# Vivado block design pfm_dynamic, xcu250-figd2104-2L-e, Vivado 2020.1
# (continued, part 2 of 3)
current_bd_instance /slr1

create_bd_cell -type hier reset_controllers
create_bd_cell -type ip -vlnv xilinx.com:ip:axi_interconnect:2.1 axi_user_interconnect
set_property -dict [list \
  CONFIG.M00_HAS_REGSLICE 4 \
  CONFIG.M01_HAS_REGSLICE 4 \
  CONFIG.S00_HAS_REGSLICE 4 \
] [get_bd_cells axi_user_interconnect]
create_bd_cell -type ip -vlnv xilinx.com:ip:axi_interconnect:2.1 interconnect_axilite_user
set_property -dict [list \
  CONFIG.M00_HAS_REGSLICE 4 \
  CONFIG.M01_HAS_REGSLICE 4 \
  CONFIG.M02_HAS_REGSLICE 4 \
  CONFIG.M03_HAS_REGSLICE 4 \
  CONFIG.M04_HAS_REGSLICE 4 \
  CONFIG.M05_HAS_REGSLICE 4 \
  CONFIG.M06_HAS_REGSLICE 4 \
  CONFIG.M07_HAS_REGSLICE 4 \
  CONFIG.M08_HAS_REGSLICE 4 \
  CONFIG.M09_HAS_REGSLICE 4 \
  CONFIG.M10_HAS_REGSLICE 4 \
  CONFIG.M11_HAS_REGSLICE 4 \
  CONFIG.M12_HAS_REGSLICE 4 \
  CONFIG.M13_HAS_REGSLICE 4 \
  CONFIG.M14_HAS_REGSLICE 4 \
  CONFIG.M15_HAS_REGSLICE 4 \
  CONFIG.M16_HAS_REGSLICE 4 \
  CONFIG.M17_HAS_REGSLICE 4 \
  CONFIG.M18_HAS_REGSLICE 4 \
  CONFIG.M19_HAS_REGSLICE 4 \
  CONFIG.M20_HAS_REGSLICE 4 \
  CONFIG.M21_HAS_REGSLICE 4 \
  CONFIG.M22_HAS_REGSLICE 4 \
  CONFIG.M23_HAS_REGSLICE 4 \
  CONFIG.M24_HAS_REGSLICE 4 \
  CONFIG.M25_HAS_REGSLICE 4 \
  CONFIG.M26_HAS_REGSLICE 4 \
  CONFIG.M27_HAS_REGSLICE 4 \
  CONFIG.M28_HAS_REGSLICE 4 \
  CONFIG.M29_HAS_REGSLICE 4 \
  CONFIG.M30_HAS_REGSLICE 4 \
  CONFIG.M31_HAS_REGSLICE 4 \
  CONFIG.M32_HAS_REGSLICE 4 \
  CONFIG.M33_HAS_REGSLICE 4 \
  CONFIG.M34_HAS_REGSLICE 4 \
  CONFIG.M35_HAS_REGSLICE 4 \
  CONFIG.M36_HAS_REGSLICE 4 \
  CONFIG.M37_HAS_REGSLICE 4 \
  CONFIG.M38_HAS_REGSLICE 4 \
  CONFIG.M39_HAS_REGSLICE 4 \
  CONFIG.M40_HAS_REGSLICE 4 \
  CONFIG.M41_HAS_REGSLICE 4 \
  CONFIG.M42_HAS_REGSLICE 4 \
  CONFIG.M43_HAS_REGSLICE 4 \
  CONFIG.M44_HAS_REGSLICE 4 \
  CONFIG.M45_HAS_REGSLICE 4 \
  CONFIG.M46_HAS_REGSLICE 4 \
  CONFIG.M47_HAS_REGSLICE 4 \
  CONFIG.M48_HAS_REGSLICE 4 \
  CONFIG.M49_HAS_REGSLICE 4 \
  CONFIG.M50_HAS_REGSLICE 4 \
  CONFIG.M51_HAS_REGSLICE 4 \
  CONFIG.M52_HAS_REGSLICE 4 \
  CONFIG.M53_HAS_REGSLICE 4 \
  CONFIG.M54_HAS_REGSLICE 4 \
  CONFIG.M55_HAS_REGSLICE 4 \
  CONFIG.M56_HAS_REGSLICE 4 \
  CONFIG.M57_HAS_REGSLICE 4 \
  CONFIG.M58_HAS_REGSLICE 4 \
  CONFIG.M59_HAS_REGSLICE 4 \
  CONFIG.M60_HAS_REGSLICE 4 \
  CONFIG.M61_HAS_REGSLICE 4 \
  CONFIG.M62_HAS_REGSLICE 4 \
  CONFIG.M63_HAS_REGSLICE 4 \
  CONFIG.NUM_MI 1 \
  CONFIG.NUM_SI 1 \
  CONFIG.S00_HAS_REGSLICE 4 \
  CONFIG.SLR_ASSIGNMENTS SLR1 \
] [get_bd_cells interconnect_axilite_user]
create_bd_cell -type ip -vlnv xilinx.com:ip:axi_clock_converter:2.1 axi_cdc_data
set_property -dict {CONFIG.SLR_ASSIGNMENTS SLR1} [get_bd_cells axi_cdc_data]
create_bd_cell -type ip -vlnv xilinx.com:ip:axi_gpio:2.0 axi_gpio_null
create_bd_cell -type ip -vlnv xilinx.com:ip:axi_register_slice:2.1 axi_user_slrcrossing_mi
set_property -dict [list \
  CONFIG.ADDR_WIDTH 26 \
  CONFIG.PROTOCOL AXI4LITE \
  CONFIG.READ_WRITE_MODE READ_WRITE \
  CONFIG.REG_AR 7 \
  CONFIG.REG_AW 7 \
  CONFIG.REG_B 9 \
  CONFIG.REG_R 9 \
  CONFIG.REG_W 7 \
] [get_bd_cells axi_user_slrcrossing_mi]
create_bd_cell -type ip -vlnv xilinx.com:ip:axi_register_slice:2.1 axi_user_slrcrossing_si
set_property -dict [list \
  CONFIG.ADDR_WIDTH 26 \
  CONFIG.PROTOCOL AXI4LITE \
  CONFIG.READ_WRITE_MODE READ_WRITE \
  CONFIG.REG_AR 9 \
  CONFIG.REG_AW 9 \
  CONFIG.REG_B 7 \
  CONFIG.REG_R 7 \
  CONFIG.REG_W 9 \
] [get_bd_cells axi_user_slrcrossing_si]
create_bd_cell -type ip -vlnv xilinx.com:ip:axi_vip:1.1 axi_vip_data
create_bd_cell -type ip -vlnv xilinx.com:ip:axi_register_slice:2.1 regslice_data
set_property -dict [list \
  CONFIG.ADDR_WIDTH 39 \
  CONFIG.DATA_WIDTH 512 \
  CONFIG.ID_WIDTH 3 \
  CONFIG.PROTOCOL AXI4 \
  CONFIG.READ_WRITE_MODE READ_WRITE \
  CONFIG.REG_AR 1 \
  CONFIG.REG_AW 1 \
  CONFIG.REG_B 1 \
  CONFIG.REG_W 1 \
  CONFIG.SLR_ASSIGNMENTS SLR1 \
] [get_bd_cells regslice_data]

# ---- hierarchy /slr1/reset_controllers ----
current_bd_instance /slr1/reset_controllers
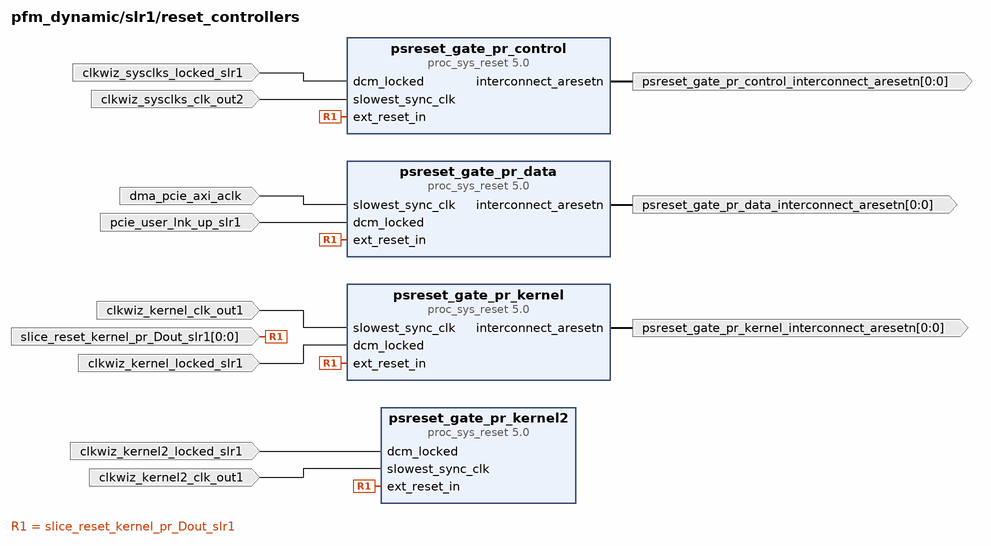
[diagram p11: block diagram inside /slr1/reset_controllers]
create_bd_pin -dir I -type clk clkwiz_kernel2_clk_out1
create_bd_pin -dir I clkwiz_kernel2_locked_slr1
create_bd_pin -dir I -type clk clkwiz_kernel_clk_out1
create_bd_pin -dir I clkwiz_kernel_locked_slr1
create_bd_pin -dir I -type clk clkwiz_sysclks_clk_out2
create_bd_pin -dir I clkwiz_sysclks_locked_slr1
create_bd_pin -dir I -type clk dma_pcie_axi_aclk
create_bd_pin -dir I pcie_user_lnk_up_slr1
create_bd_pin -dir O -from 0 -to 0 -type rst psreset_gate_pr_control_interconnect_aresetn
create_bd_pin -dir O -from 0 -to 0 -type rst psreset_gate_pr_data_interconnect_aresetn
create_bd_pin -dir O -from 0 -to 0 -type rst psreset_gate_pr_kernel_interconnect_aresetn
create_bd_pin -dir I -from 0 -to 0 -type rst slice_reset_kernel_pr_Dout_slr1

create_bd_cell -type ip -vlnv xilinx.com:ip:proc_sys_reset:5.0 psreset_gate_pr_control
set_property -dict [list \
  CONFIG.C_AUX_RESET_HIGH 0 \
  CONFIG.C_AUX_RST_WIDTH 1 \
  CONFIG.C_EXT_RST_WIDTH 1 \
  CONFIG.SLR_ASSIGNMENTS SLR1 \
] [get_bd_cells psreset_gate_pr_control]
create_bd_cell -type ip -vlnv xilinx.com:ip:proc_sys_reset:5.0 psreset_gate_pr_data
set_property -dict [list \
  CONFIG.C_AUX_RESET_HIGH 0 \
  CONFIG.C_AUX_RST_WIDTH 1 \
  CONFIG.C_EXT_RST_WIDTH 1 \
  CONFIG.SLR_ASSIGNMENTS SLR1 \
] [get_bd_cells psreset_gate_pr_data]
create_bd_cell -type ip -vlnv xilinx.com:ip:proc_sys_reset:5.0 psreset_gate_pr_kernel
set_property -dict [list \
  CONFIG.C_AUX_RESET_HIGH 0 \
  CONFIG.C_AUX_RST_WIDTH 1 \
  CONFIG.C_EXT_RST_WIDTH 1 \
  CONFIG.SLR_ASSIGNMENTS SLR1 \
] [get_bd_cells psreset_gate_pr_kernel]
create_bd_cell -type ip -vlnv xilinx.com:ip:proc_sys_reset:5.0 psreset_gate_pr_kernel2
set_property -dict [list \
  CONFIG.C_AUX_RESET_HIGH 0 \
  CONFIG.C_AUX_RST_WIDTH 1 \
  CONFIG.C_EXT_RST_WIDTH 1 \
  CONFIG.SLR_ASSIGNMENTS SLR1 \
] [get_bd_cells psreset_gate_pr_kernel2]

# ---- hierarchy /slr2 ----
current_bd_instance /slr2
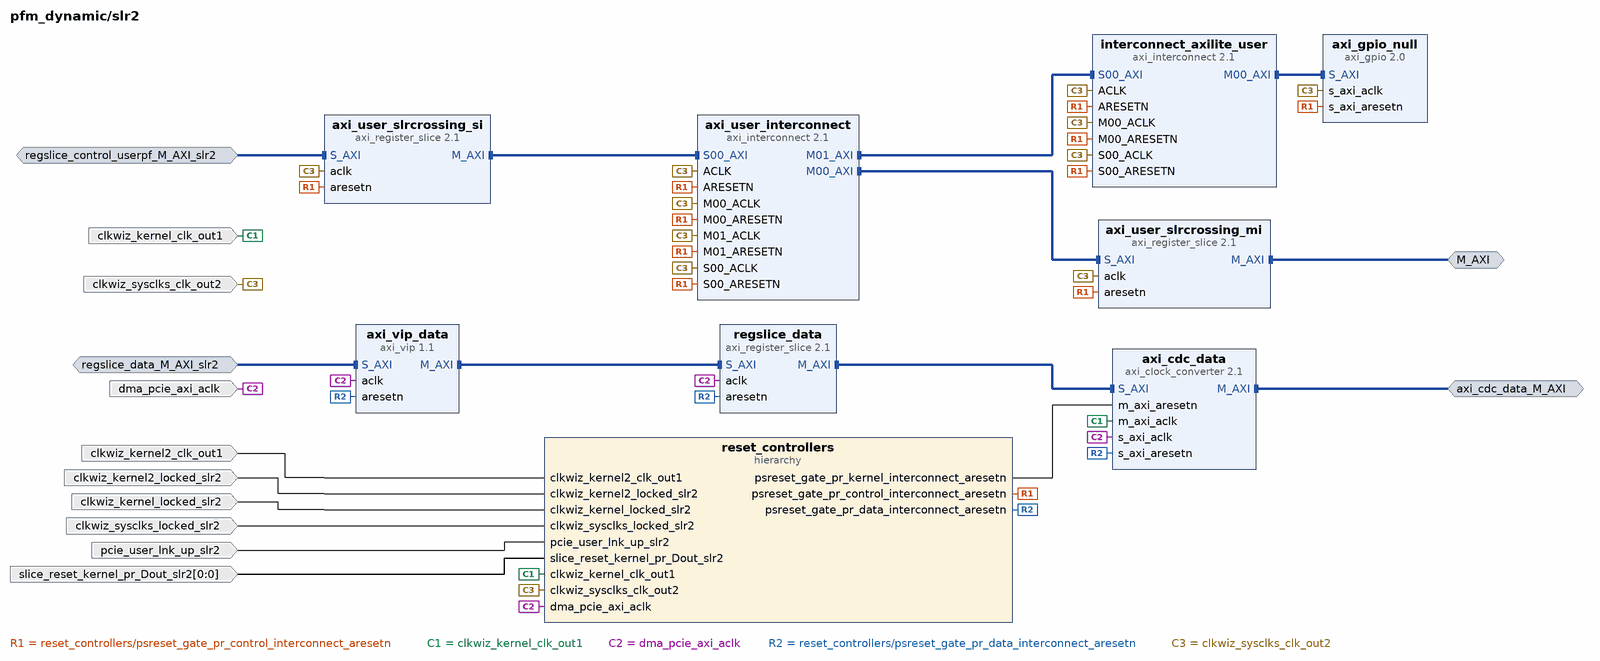
[diagram p12: block diagram inside /slr2]
create_bd_intf_pin -mode Master -vlnv xilinx.com:interface:aximm_rtl:1.0 M_AXI
create_bd_intf_pin -mode Master -vlnv xilinx.com:interface:aximm_rtl:1.0 axi_cdc_data_M_AXI
create_bd_intf_pin -mode Slave -vlnv xilinx.com:interface:aximm_rtl:1.0 regslice_control_userpf_M_AXI_slr2
create_bd_intf_pin -mode Slave -vlnv xilinx.com:interface:aximm_rtl:1.0 regslice_data_M_AXI_slr2
create_bd_pin -dir I -type clk clkwiz_kernel2_clk_out1
create_bd_pin -dir I clkwiz_kernel2_locked_slr2
create_bd_pin -dir I -type clk clkwiz_kernel_clk_out1
create_bd_pin -dir I clkwiz_kernel_locked_slr2
create_bd_pin -dir I -type clk clkwiz_sysclks_clk_out2
create_bd_pin -dir I clkwiz_sysclks_locked_slr2
create_bd_pin -dir I -type clk dma_pcie_axi_aclk
create_bd_pin -dir I pcie_user_lnk_up_slr2
create_bd_pin -dir I -from 0 -to 0 -type rst slice_reset_kernel_pr_Dout_slr2

create_bd_cell -type hier reset_controllers
create_bd_cell -type ip -vlnv xilinx.com:ip:axi_interconnect:2.1 axi_user_interconnect
set_property -dict [list \
  CONFIG.M00_HAS_REGSLICE 4 \
  CONFIG.M01_HAS_REGSLICE 4 \
  CONFIG.S00_HAS_REGSLICE 4 \
] [get_bd_cells axi_user_interconnect]
create_bd_cell -type ip -vlnv xilinx.com:ip:axi_interconnect:2.1 interconnect_axilite_user
set_property -dict [list \
  CONFIG.M00_HAS_REGSLICE 4 \
  CONFIG.M01_HAS_REGSLICE 4 \
  CONFIG.M02_HAS_REGSLICE 4 \
  CONFIG.M03_HAS_REGSLICE 4 \
  CONFIG.M04_HAS_REGSLICE 4 \
  CONFIG.M05_HAS_REGSLICE 4 \
  CONFIG.M06_HAS_REGSLICE 4 \
  CONFIG.M07_HAS_REGSLICE 4 \
  CONFIG.M08_HAS_REGSLICE 4 \
  CONFIG.M09_HAS_REGSLICE 4 \
  CONFIG.M10_HAS_REGSLICE 4 \
  CONFIG.M11_HAS_REGSLICE 4 \
  CONFIG.M12_HAS_REGSLICE 4 \
  CONFIG.M13_HAS_REGSLICE 4 \
  CONFIG.M14_HAS_REGSLICE 4 \
  CONFIG.M15_HAS_REGSLICE 4 \
  CONFIG.M16_HAS_REGSLICE 4 \
  CONFIG.M17_HAS_REGSLICE 4 \
  CONFIG.M18_HAS_REGSLICE 4 \
  CONFIG.M19_HAS_REGSLICE 4 \
  CONFIG.M20_HAS_REGSLICE 4 \
  CONFIG.M21_HAS_REGSLICE 4 \
  CONFIG.M22_HAS_REGSLICE 4 \
  CONFIG.M23_HAS_REGSLICE 4 \
  CONFIG.M24_HAS_REGSLICE 4 \
  CONFIG.M25_HAS_REGSLICE 4 \
  CONFIG.M26_HAS_REGSLICE 4 \
  CONFIG.M27_HAS_REGSLICE 4 \
  CONFIG.M28_HAS_REGSLICE 4 \
  CONFIG.M29_HAS_REGSLICE 4 \
  CONFIG.M30_HAS_REGSLICE 4 \
  CONFIG.M31_HAS_REGSLICE 4 \
  CONFIG.M32_HAS_REGSLICE 4 \
  CONFIG.M33_HAS_REGSLICE 4 \
  CONFIG.M34_HAS_REGSLICE 4 \
  CONFIG.M35_HAS_REGSLICE 4 \
  CONFIG.M36_HAS_REGSLICE 4 \
  CONFIG.M37_HAS_REGSLICE 4 \
  CONFIG.M38_HAS_REGSLICE 4 \
  CONFIG.M39_HAS_REGSLICE 4 \
  CONFIG.M40_HAS_REGSLICE 4 \
  CONFIG.M41_HAS_REGSLICE 4 \
  CONFIG.M42_HAS_REGSLICE 4 \
  CONFIG.M43_HAS_REGSLICE 4 \
  CONFIG.M44_HAS_REGSLICE 4 \
  CONFIG.M45_HAS_REGSLICE 4 \
  CONFIG.M46_HAS_REGSLICE 4 \
  CONFIG.M47_HAS_REGSLICE 4 \
  CONFIG.M48_HAS_REGSLICE 4 \
  CONFIG.M49_HAS_REGSLICE 4 \
  CONFIG.M50_HAS_REGSLICE 4 \
  CONFIG.M51_HAS_REGSLICE 4 \
  CONFIG.M52_HAS_REGSLICE 4 \
  CONFIG.M53_HAS_REGSLICE 4 \
  CONFIG.M54_HAS_REGSLICE 4 \
  CONFIG.M55_HAS_REGSLICE 4 \
  CONFIG.M56_HAS_REGSLICE 4 \
  CONFIG.M57_HAS_REGSLICE 4 \
  CONFIG.M58_HAS_REGSLICE 4 \
  CONFIG.M59_HAS_REGSLICE 4 \
  CONFIG.M60_HAS_REGSLICE 4 \
  CONFIG.M61_HAS_REGSLICE 4 \
  CONFIG.M62_HAS_REGSLICE 4 \
  CONFIG.M63_HAS_REGSLICE 4 \
  CONFIG.NUM_MI 1 \
  CONFIG.NUM_SI 1 \
  CONFIG.S00_HAS_REGSLICE 4 \
  CONFIG.SLR_ASSIGNMENTS SLR2 \
] [get_bd_cells interconnect_axilite_user]
create_bd_cell -type ip -vlnv xilinx.com:ip:axi_clock_converter:2.1 axi_cdc_data
set_property -dict {CONFIG.SLR_ASSIGNMENTS SLR2} [get_bd_cells axi_cdc_data]
create_bd_cell -type ip -vlnv xilinx.com:ip:axi_gpio:2.0 axi_gpio_null
create_bd_cell -type ip -vlnv xilinx.com:ip:axi_register_slice:2.1 axi_user_slrcrossing_mi
set_property -dict [list \
  CONFIG.ADDR_WIDTH 26 \
  CONFIG.PROTOCOL AXI4LITE \
  CONFIG.READ_WRITE_MODE READ_WRITE \
  CONFIG.REG_AR 7 \
  CONFIG.REG_AW 7 \
  CONFIG.REG_B 9 \
  CONFIG.REG_R 9 \
  CONFIG.REG_W 7 \
] [get_bd_cells axi_user_slrcrossing_mi]
create_bd_cell -type ip -vlnv xilinx.com:ip:axi_register_slice:2.1 axi_user_slrcrossing_si
set_property -dict [list \
  CONFIG.ADDR_WIDTH 26 \
  CONFIG.PROTOCOL AXI4LITE \
  CONFIG.READ_WRITE_MODE READ_WRITE \
  CONFIG.REG_AR 9 \
  CONFIG.REG_AW 9 \
  CONFIG.REG_B 7 \
  CONFIG.REG_R 7 \
  CONFIG.REG_W 9 \
] [get_bd_cells axi_user_slrcrossing_si]
create_bd_cell -type ip -vlnv xilinx.com:ip:axi_vip:1.1 axi_vip_data
create_bd_cell -type ip -vlnv xilinx.com:ip:axi_register_slice:2.1 regslice_data
set_property -dict [list \
  CONFIG.ADDR_WIDTH 39 \
  CONFIG.DATA_WIDTH 512 \
  CONFIG.ID_WIDTH 3 \
  CONFIG.PROTOCOL AXI4 \
  CONFIG.READ_WRITE_MODE READ_WRITE \
  CONFIG.REG_AR 1 \
  CONFIG.REG_AW 1 \
  CONFIG.REG_B 1 \
  CONFIG.REG_W 1 \
  CONFIG.SLR_ASSIGNMENTS SLR2 \
] [get_bd_cells regslice_data]

# ---- hierarchy /slr2/reset_controllers ----
current_bd_instance /slr2/reset_controllers
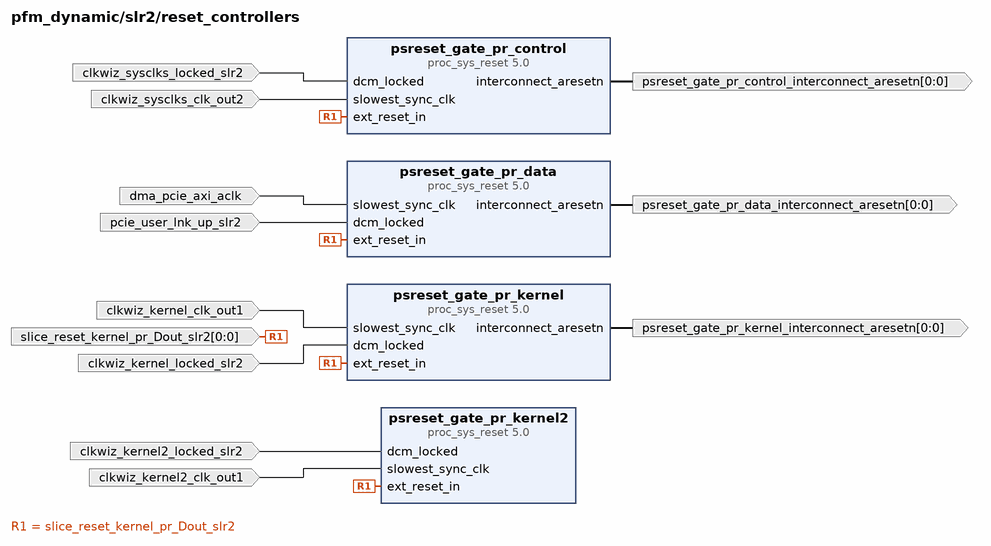
[diagram p13: block diagram inside /slr2/reset_controllers]
create_bd_pin -dir I -type clk clkwiz_kernel2_clk_out1
create_bd_pin -dir I clkwiz_kernel2_locked_slr2
create_bd_pin -dir I -type clk clkwiz_kernel_clk_out1
create_bd_pin -dir I clkwiz_kernel_locked_slr2
create_bd_pin -dir I -type clk clkwiz_sysclks_clk_out2
create_bd_pin -dir I clkwiz_sysclks_locked_slr2
create_bd_pin -dir I -type clk dma_pcie_axi_aclk
create_bd_pin -dir I pcie_user_lnk_up_slr2
create_bd_pin -dir O -from 0 -to 0 -type rst psreset_gate_pr_control_interconnect_aresetn
create_bd_pin -dir O -from 0 -to 0 -type rst psreset_gate_pr_data_interconnect_aresetn
create_bd_pin -dir O -from 0 -to 0 -type rst psreset_gate_pr_kernel_interconnect_aresetn
create_bd_pin -dir I -from 0 -to 0 -type rst slice_reset_kernel_pr_Dout_slr2

create_bd_cell -type ip -vlnv xilinx.com:ip:proc_sys_reset:5.0 psreset_gate_pr_control
set_property -dict [list \
  CONFIG.C_AUX_RESET_HIGH 0 \
  CONFIG.C_AUX_RST_WIDTH 1 \
  CONFIG.C_EXT_RST_WIDTH 1 \
  CONFIG.SLR_ASSIGNMENTS SLR2 \
] [get_bd_cells psreset_gate_pr_control]
create_bd_cell -type ip -vlnv xilinx.com:ip:proc_sys_reset:5.0 psreset_gate_pr_data
set_property -dict [list \
  CONFIG.C_AUX_RESET_HIGH 0 \
  CONFIG.C_AUX_RST_WIDTH 1 \
  CONFIG.C_EXT_RST_WIDTH 1 \
  CONFIG.SLR_ASSIGNMENTS SLR2 \
] [get_bd_cells psreset_gate_pr_data]
create_bd_cell -type ip -vlnv xilinx.com:ip:proc_sys_reset:5.0 psreset_gate_pr_kernel
set_property -dict [list \
  CONFIG.C_AUX_RESET_HIGH 0 \
  CONFIG.C_AUX_RST_WIDTH 1 \
  CONFIG.C_EXT_RST_WIDTH 1 \
  CONFIG.SLR_ASSIGNMENTS SLR2 \
] [get_bd_cells psreset_gate_pr_kernel]
create_bd_cell -type ip -vlnv xilinx.com:ip:proc_sys_reset:5.0 psreset_gate_pr_kernel2
set_property -dict [list \
  CONFIG.C_AUX_RESET_HIGH 0 \
  CONFIG.C_AUX_RST_WIDTH 1 \
  CONFIG.C_EXT_RST_WIDTH 1 \
  CONFIG.SLR_ASSIGNMENTS SLR2 \
] [get_bd_cells psreset_gate_pr_kernel2]

# ---- hierarchy /slr3 ----
current_bd_instance /slr3
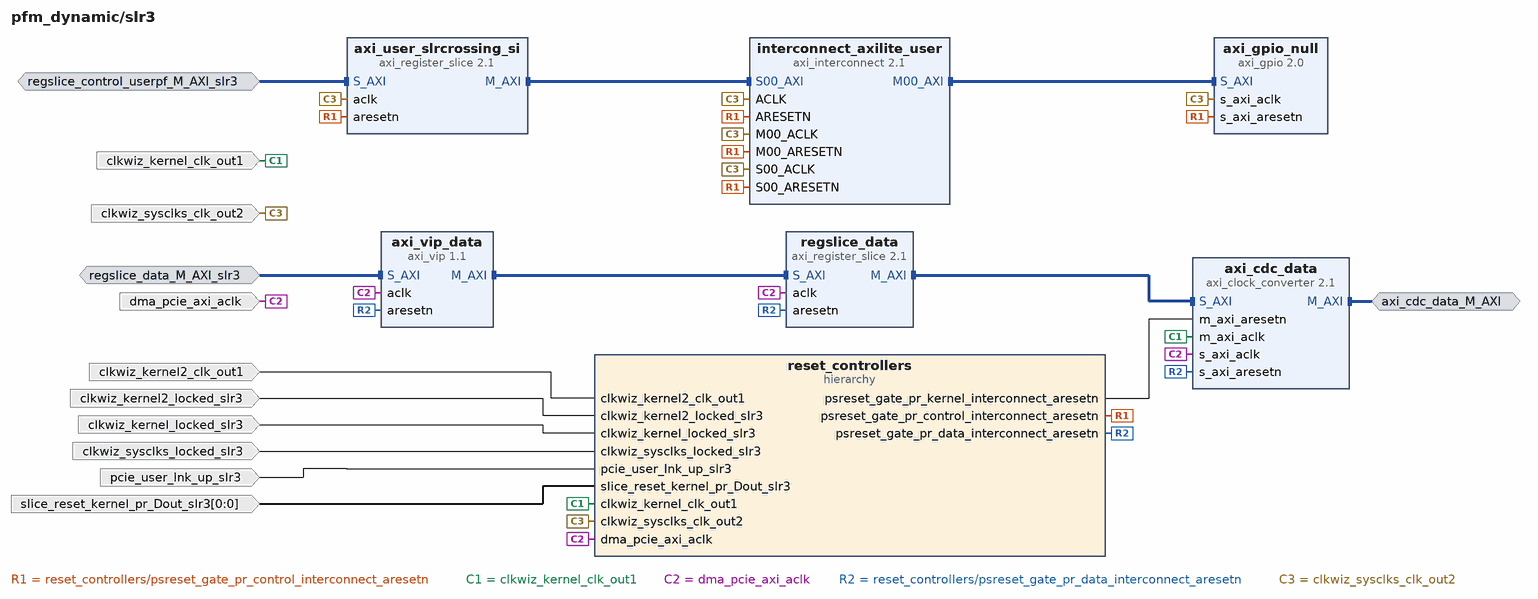
[diagram p14: block diagram inside /slr3]
create_bd_intf_pin -mode Master -vlnv xilinx.com:interface:aximm_rtl:1.0 axi_cdc_data_M_AXI
create_bd_intf_pin -mode Slave -vlnv xilinx.com:interface:aximm_rtl:1.0 regslice_control_userpf_M_AXI_slr3
create_bd_intf_pin -mode Slave -vlnv xilinx.com:interface:aximm_rtl:1.0 regslice_data_M_AXI_slr3
create_bd_pin -dir I -type clk clkwiz_kernel2_clk_out1
create_bd_pin -dir I clkwiz_kernel2_locked_slr3
create_bd_pin -dir I -type clk clkwiz_kernel_clk_out1
create_bd_pin -dir I clkwiz_kernel_locked_slr3
create_bd_pin -dir I -type clk clkwiz_sysclks_clk_out2
create_bd_pin -dir I clkwiz_sysclks_locked_slr3
create_bd_pin -dir I -type clk dma_pcie_axi_aclk
create_bd_pin -dir I pcie_user_lnk_up_slr3
create_bd_pin -dir I -from 0 -to 0 -type rst slice_reset_kernel_pr_Dout_slr3

create_bd_cell -type hier reset_controllers
create_bd_cell -type ip -vlnv xilinx.com:ip:axi_interconnect:2.1 interconnect_axilite_user
set_property -dict [list \
  CONFIG.M00_HAS_REGSLICE 4 \
  CONFIG.M01_HAS_REGSLICE 4 \
  CONFIG.M02_HAS_REGSLICE 4 \
  CONFIG.M03_HAS_REGSLICE 4 \
  CONFIG.M04_HAS_REGSLICE 4 \
  CONFIG.M05_HAS_REGSLICE 4 \
  CONFIG.M06_HAS_REGSLICE 4 \
  CONFIG.M07_HAS_REGSLICE 4 \
  CONFIG.M08_HAS_REGSLICE 4 \
  CONFIG.M09_HAS_REGSLICE 4 \
  CONFIG.M10_HAS_REGSLICE 4 \
  CONFIG.M11_HAS_REGSLICE 4 \
  CONFIG.M12_HAS_REGSLICE 4 \
  CONFIG.M13_HAS_REGSLICE 4 \
  CONFIG.M14_HAS_REGSLICE 4 \
  CONFIG.M15_HAS_REGSLICE 4 \
  CONFIG.M16_HAS_REGSLICE 4 \
  CONFIG.M17_HAS_REGSLICE 4 \
  CONFIG.M18_HAS_REGSLICE 4 \
  CONFIG.M19_HAS_REGSLICE 4 \
  CONFIG.M20_HAS_REGSLICE 4 \
  CONFIG.M21_HAS_REGSLICE 4 \
  CONFIG.M22_HAS_REGSLICE 4 \
  CONFIG.M23_HAS_REGSLICE 4 \
  CONFIG.M24_HAS_REGSLICE 4 \
  CONFIG.M25_HAS_REGSLICE 4 \
  CONFIG.M26_HAS_REGSLICE 4 \
  CONFIG.M27_HAS_REGSLICE 4 \
  CONFIG.M28_HAS_REGSLICE 4 \
  CONFIG.M29_HAS_REGSLICE 4 \
  CONFIG.M30_HAS_REGSLICE 4 \
  CONFIG.M31_HAS_REGSLICE 4 \
  CONFIG.M32_HAS_REGSLICE 4 \
  CONFIG.M33_HAS_REGSLICE 4 \
  CONFIG.M34_HAS_REGSLICE 4 \
  CONFIG.M35_HAS_REGSLICE 4 \
  CONFIG.M36_HAS_REGSLICE 4 \
  CONFIG.M37_HAS_REGSLICE 4 \
  CONFIG.M38_HAS_REGSLICE 4 \
  CONFIG.M39_HAS_REGSLICE 4 \
  CONFIG.M40_HAS_REGSLICE 4 \
  CONFIG.M41_HAS_REGSLICE 4 \
  CONFIG.M42_HAS_REGSLICE 4 \
  CONFIG.M43_HAS_REGSLICE 4 \
  CONFIG.M44_HAS_REGSLICE 4 \
  CONFIG.M45_HAS_REGSLICE 4 \
  CONFIG.M46_HAS_REGSLICE 4 \
  CONFIG.M47_HAS_REGSLICE 4 \
  CONFIG.M48_HAS_REGSLICE 4 \
  CONFIG.M49_HAS_REGSLICE 4 \
  CONFIG.M50_HAS_REGSLICE 4 \
  CONFIG.M51_HAS_REGSLICE 4 \
  CONFIG.M52_HAS_REGSLICE 4 \
  CONFIG.M53_HAS_REGSLICE 4 \
  CONFIG.M54_HAS_REGSLICE 4 \
  CONFIG.M55_HAS_REGSLICE 4 \
  CONFIG.M56_HAS_REGSLICE 4 \
  CONFIG.M57_HAS_REGSLICE 4 \
  CONFIG.M58_HAS_REGSLICE 4 \
  CONFIG.M59_HAS_REGSLICE 4 \
  CONFIG.M60_HAS_REGSLICE 4 \
  CONFIG.M61_HAS_REGSLICE 4 \
  CONFIG.M62_HAS_REGSLICE 4 \
  CONFIG.M63_HAS_REGSLICE 4 \
  CONFIG.NUM_MI 1 \
  CONFIG.NUM_SI 1 \
  CONFIG.S00_HAS_REGSLICE 4 \
  CONFIG.SLR_ASSIGNMENTS SLR3 \
] [get_bd_cells interconnect_axilite_user]
create_bd_cell -type ip -vlnv xilinx.com:ip:axi_clock_converter:2.1 axi_cdc_data
set_property -dict {CONFIG.SLR_ASSIGNMENTS SLR3} [get_bd_cells axi_cdc_data]
create_bd_cell -type ip -vlnv xilinx.com:ip:axi_gpio:2.0 axi_gpio_null
create_bd_cell -type ip -vlnv xilinx.com:ip:axi_register_slice:2.1 axi_user_slrcrossing_si
set_property -dict [list \
  CONFIG.ADDR_WIDTH 26 \
  CONFIG.PROTOCOL AXI4LITE \
  CONFIG.READ_WRITE_MODE READ_WRITE \
  CONFIG.REG_AR 9 \
  CONFIG.REG_AW 9 \
  CONFIG.REG_B 7 \
  CONFIG.REG_R 7 \
  CONFIG.REG_W 9 \
] [get_bd_cells axi_user_slrcrossing_si]
create_bd_cell -type ip -vlnv xilinx.com:ip:axi_vip:1.1 axi_vip_data
create_bd_cell -type ip -vlnv xilinx.com:ip:axi_register_slice:2.1 regslice_data
set_property -dict [list \
  CONFIG.ADDR_WIDTH 39 \
  CONFIG.DATA_WIDTH 512 \
  CONFIG.ID_WIDTH 3 \
  CONFIG.PROTOCOL AXI4 \
  CONFIG.READ_WRITE_MODE READ_WRITE \
  CONFIG.REG_AR 1 \
  CONFIG.REG_AW 1 \
  CONFIG.REG_B 1 \
  CONFIG.REG_W 1 \
  CONFIG.SLR_ASSIGNMENTS SLR3 \
] [get_bd_cells regslice_data]

# ---- hierarchy /slr3/reset_controllers ----
current_bd_instance /slr3/reset_controllers
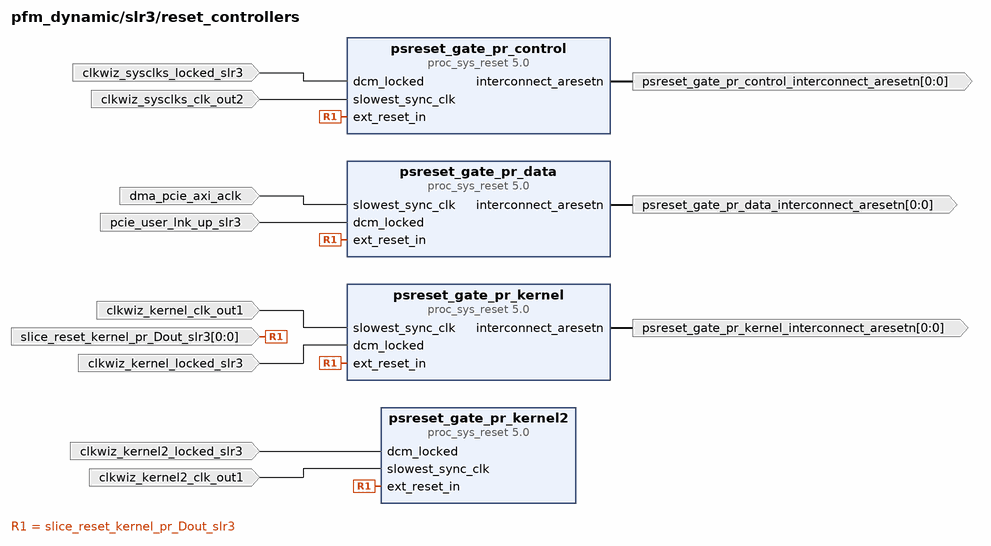
[diagram p15: block diagram inside /slr3/reset_controllers]
create_bd_pin -dir I -type clk clkwiz_kernel2_clk_out1
create_bd_pin -dir I clkwiz_kernel2_locked_slr3
create_bd_pin -dir I -type clk clkwiz_kernel_clk_out1
create_bd_pin -dir I clkwiz_kernel_locked_slr3
create_bd_pin -dir I -type clk clkwiz_sysclks_clk_out2
create_bd_pin -dir I clkwiz_sysclks_locked_slr3
create_bd_pin -dir I -type clk dma_pcie_axi_aclk
create_bd_pin -dir I pcie_user_lnk_up_slr3
create_bd_pin -dir O -from 0 -to 0 -type rst psreset_gate_pr_control_interconnect_aresetn
create_bd_pin -dir O -from 0 -to 0 -type rst psreset_gate_pr_data_interconnect_aresetn
create_bd_pin -dir O -from 0 -to 0 -type rst psreset_gate_pr_kernel_interconnect_aresetn
create_bd_pin -dir I -from 0 -to 0 -type rst slice_reset_kernel_pr_Dout_slr3

create_bd_cell -type ip -vlnv xilinx.com:ip:proc_sys_reset:5.0 psreset_gate_pr_control
set_property -dict [list \
  CONFIG.C_AUX_RESET_HIGH 0 \
  CONFIG.C_AUX_RST_WIDTH 1 \
  CONFIG.C_EXT_RST_WIDTH 1 \
  CONFIG.SLR_ASSIGNMENTS SLR3 \
] [get_bd_cells psreset_gate_pr_control]
create_bd_cell -type ip -vlnv xilinx.com:ip:proc_sys_reset:5.0 psreset_gate_pr_data
set_property -dict [list \
  CONFIG.C_AUX_RESET_HIGH 0 \
  CONFIG.C_AUX_RST_WIDTH 1 \
  CONFIG.C_EXT_RST_WIDTH 1 \
  CONFIG.SLR_ASSIGNMENTS SLR3 \
] [get_bd_cells psreset_gate_pr_data]
create_bd_cell -type ip -vlnv xilinx.com:ip:proc_sys_reset:5.0 psreset_gate_pr_kernel
set_property -dict [list \
  CONFIG.C_AUX_RESET_HIGH 0 \
  CONFIG.C_AUX_RST_WIDTH 1 \
  CONFIG.C_EXT_RST_WIDTH 1 \
  CONFIG.SLR_ASSIGNMENTS SLR3 \
] [get_bd_cells psreset_gate_pr_kernel]
create_bd_cell -type ip -vlnv xilinx.com:ip:proc_sys_reset:5.0 psreset_gate_pr_kernel2
set_property -dict [list \
  CONFIG.C_AUX_RESET_HIGH 0 \
  CONFIG.C_AUX_RST_WIDTH 1 \
  CONFIG.C_EXT_RST_WIDTH 1 \
  CONFIG.SLR_ASSIGNMENTS SLR3 \
] [get_bd_cells psreset_gate_pr_kernel2]

# ---- connections ----

current_bd_instance /interrupt_concat
connect_bd_net [get_bd_pins xlconcat_interrupt_0/dout] [get_bd_pins xlconcat_interrupt/In0]
connect_bd_net [get_bd_pins xlconcat_interrupt_1/dout] [get_bd_pins xlconcat_interrupt/In1]
connect_bd_net [get_bd_pins xlconcat_interrupt_2/dout] [get_bd_pins xlconcat_interrupt/In2]
connect_bd_net [get_bd_pins xlconcat_interrupt_3/dout] [get_bd_pins xlconcat_interrupt/In3]
connect_bd_net [get_bd_pins xlconcat_interrupt/dout] [get_bd_pins xlconcat_interrupt_dout]
connect_bd_net [get_bd_pins xlconstant_gnd/dout] \
  [get_bd_pins xlconcat_interrupt_0/In4] [get_bd_pins xlconcat_interrupt_0/In5] [get_bd_pins xlconcat_interrupt_0/In6] \
  [get_bd_pins xlconcat_interrupt_0/In7] [get_bd_pins xlconcat_interrupt_0/In8] [get_bd_pins xlconcat_interrupt_0/In9] \
  [get_bd_pins xlconcat_interrupt_0/In10] [get_bd_pins xlconcat_interrupt_0/In11] [get_bd_pins xlconcat_interrupt_0/In12] \
  [get_bd_pins xlconcat_interrupt_0/In13] [get_bd_pins xlconcat_interrupt_0/In14] [get_bd_pins xlconcat_interrupt_0/In15] \
  [get_bd_pins xlconcat_interrupt_0/In16] [get_bd_pins xlconcat_interrupt_0/In17] [get_bd_pins xlconcat_interrupt_0/In18] \
  [get_bd_pins xlconcat_interrupt_0/In19] [get_bd_pins xlconcat_interrupt_0/In20] [get_bd_pins xlconcat_interrupt_0/In21] \
  [get_bd_pins xlconcat_interrupt_0/In22] [get_bd_pins xlconcat_interrupt_0/In23] [get_bd_pins xlconcat_interrupt_0/In24] \
  [get_bd_pins xlconcat_interrupt_0/In25] [get_bd_pins xlconcat_interrupt_0/In26] [get_bd_pins xlconcat_interrupt_0/In27] \
  [get_bd_pins xlconcat_interrupt_0/In28] [get_bd_pins xlconcat_interrupt_0/In29] [get_bd_pins xlconcat_interrupt_0/In30] \
  [get_bd_pins xlconcat_interrupt_0/In31] [get_bd_pins xlconcat_interrupt_1/In0] [get_bd_pins xlconcat_interrupt_1/In1] \
  [get_bd_pins xlconcat_interrupt_1/In2] [get_bd_pins xlconcat_interrupt_1/In3] [get_bd_pins xlconcat_interrupt_1/In4] \
  [get_bd_pins xlconcat_interrupt_1/In5] [get_bd_pins xlconcat_interrupt_1/In6] [get_bd_pins xlconcat_interrupt_1/In7] \
  [get_bd_pins xlconcat_interrupt_1/In8] [get_bd_pins xlconcat_interrupt_1/In9] [get_bd_pins xlconcat_interrupt_1/In10] \
  [get_bd_pins xlconcat_interrupt_1/In11] [get_bd_pins xlconcat_interrupt_1/In12] [get_bd_pins xlconcat_interrupt_1/In13] \
  [get_bd_pins xlconcat_interrupt_1/In14] [get_bd_pins xlconcat_interrupt_1/In15] [get_bd_pins xlconcat_interrupt_1/In16] \
  [get_bd_pins xlconcat_interrupt_1/In17] [get_bd_pins xlconcat_interrupt_1/In18] [get_bd_pins xlconcat_interrupt_1/In19] \
  [get_bd_pins xlconcat_interrupt_1/In20] [get_bd_pins xlconcat_interrupt_1/In21] [get_bd_pins xlconcat_interrupt_1/In22] \
  [get_bd_pins xlconcat_interrupt_1/In23] [get_bd_pins xlconcat_interrupt_1/In24] [get_bd_pins xlconcat_interrupt_1/In25] \
  [get_bd_pins xlconcat_interrupt_1/In26] [get_bd_pins xlconcat_interrupt_1/In27] [get_bd_pins xlconcat_interrupt_1/In28] \
  [get_bd_pins xlconcat_interrupt_1/In29] [get_bd_pins xlconcat_interrupt_1/In30] [get_bd_pins xlconcat_interrupt_1/In31] \
  [get_bd_pins xlconcat_interrupt_2/In0] [get_bd_pins xlconcat_interrupt_2/In1] [get_bd_pins xlconcat_interrupt_2/In2] \
  [get_bd_pins xlconcat_interrupt_2/In3] [get_bd_pins xlconcat_interrupt_2/In4] [get_bd_pins xlconcat_interrupt_2/In5] \
  [get_bd_pins xlconcat_interrupt_2/In6] [get_bd_pins xlconcat_interrupt_2/In7] [get_bd_pins xlconcat_interrupt_2/In8] \
  [get_bd_pins xlconcat_interrupt_2/In9] [get_bd_pins xlconcat_interrupt_2/In10] [get_bd_pins xlconcat_interrupt_2/In11] \
  [get_bd_pins xlconcat_interrupt_2/In12] [get_bd_pins xlconcat_interrupt_2/In13] [get_bd_pins xlconcat_interrupt_2/In14] \
  [get_bd_pins xlconcat_interrupt_2/In15] [get_bd_pins xlconcat_interrupt_2/In16] [get_bd_pins xlconcat_interrupt_2/In17] \
  [get_bd_pins xlconcat_interrupt_2/In18] [get_bd_pins xlconcat_interrupt_2/In19] [get_bd_pins xlconcat_interrupt_2/In20] \
  [get_bd_pins xlconcat_interrupt_2/In21] [get_bd_pins xlconcat_interrupt_2/In22] [get_bd_pins xlconcat_interrupt_2/In23] \
  [get_bd_pins xlconcat_interrupt_2/In24] [get_bd_pins xlconcat_interrupt_2/In25] [get_bd_pins xlconcat_interrupt_2/In26] \
  [get_bd_pins xlconcat_interrupt_2/In27] [get_bd_pins xlconcat_interrupt_2/In28] [get_bd_pins xlconcat_interrupt_2/In29] \
  [get_bd_pins xlconcat_interrupt_2/In30] [get_bd_pins xlconcat_interrupt_2/In31] [get_bd_pins xlconcat_interrupt_3/In0] \
  [get_bd_pins xlconcat_interrupt_3/In1] [get_bd_pins xlconcat_interrupt_3/In2] [get_bd_pins xlconcat_interrupt_3/In3] \
  [get_bd_pins xlconcat_interrupt_3/In4] [get_bd_pins xlconcat_interrupt_3/In5] [get_bd_pins xlconcat_interrupt_3/In6] \
  [get_bd_pins xlconcat_interrupt_3/In7] [get_bd_pins xlconcat_interrupt_3/In8] [get_bd_pins xlconcat_interrupt_3/In9] \
  [get_bd_pins xlconcat_interrupt_3/In10] [get_bd_pins xlconcat_interrupt_3/In11] [get_bd_pins xlconcat_interrupt_3/In12] \
  [get_bd_pins xlconcat_interrupt_3/In13] [get_bd_pins xlconcat_interrupt_3/In14] [get_bd_pins xlconcat_interrupt_3/In15] \
  [get_bd_pins xlconcat_interrupt_3/In16] [get_bd_pins xlconcat_interrupt_3/In17] [get_bd_pins xlconcat_interrupt_3/In18] \
  [get_bd_pins xlconcat_interrupt_3/In19] [get_bd_pins xlconcat_interrupt_3/In20] [get_bd_pins xlconcat_interrupt_3/In21] \
  [get_bd_pins xlconcat_interrupt_3/In22] [get_bd_pins xlconcat_interrupt_3/In23] [get_bd_pins xlconcat_interrupt_3/In24] \
  [get_bd_pins xlconcat_interrupt_3/In25] [get_bd_pins xlconcat_interrupt_3/In26] [get_bd_pins xlconcat_interrupt_3/In27] \
  [get_bd_pins xlconcat_interrupt_3/In28] [get_bd_pins xlconcat_interrupt_3/In29] [get_bd_pins xlconcat_interrupt_3/In30] \
  [get_bd_pins xlconcat_interrupt_3/In31]
connect_bd_net -net In0_1 [get_bd_pins In0] [get_bd_pins xlconcat_interrupt_0/In0]
connect_bd_net -net In1_1 [get_bd_pins In1] [get_bd_pins xlconcat_interrupt_0/In1]
connect_bd_net -net In2_1 [get_bd_pins In2] [get_bd_pins xlconcat_interrupt_0/In2]
connect_bd_net -net In3_1 [get_bd_pins In3] [get_bd_pins xlconcat_interrupt_0/In3]

current_bd_instance /slr0
connect_bd_intf_net [get_bd_intf_pins M01_AXI] [get_bd_intf_pins interconnect_axilite_user/M01_AXI]
connect_bd_intf_net [get_bd_intf_pins M02_AXI] [get_bd_intf_pins interconnect_axilite_user/M02_AXI]
connect_bd_intf_net [get_bd_intf_pins M04_AXI] [get_bd_intf_pins interconnect_axilite_user/M04_AXI]
connect_bd_intf_net [get_bd_intf_pins M03_AXI] [get_bd_intf_pins interconnect_axilite_user/M03_AXI]
connect_bd_intf_net [get_bd_intf_pins regslice_data_M_AXI_slr0] [get_bd_intf_pins axi_vip_data/S_AXI]
connect_bd_intf_net [get_bd_intf_pins axi_cdc_data/S_AXI] [get_bd_intf_pins regslice_data/M_AXI]
connect_bd_intf_net [get_bd_intf_pins axi_gpio_null/S_AXI] [get_bd_intf_pins interconnect_axilite_user/M00_AXI]
connect_bd_intf_net [get_bd_intf_pins regslice_control_userpf_M_AXI] [get_bd_intf_pins axi_vip_ctrl_userpf/S_AXI]
connect_bd_intf_net [get_bd_intf_pins regslice_control_periph_M_AXI] [get_bd_intf_pins freq_counter_0/axil]
connect_bd_intf_net [get_bd_intf_pins axi_user_interconnect/S00_AXI] [get_bd_intf_pins axi_vip_ctrl_userpf/M_AXI]
connect_bd_intf_net [get_bd_intf_pins axi_vip_control_mgntpf/M_AXI] [get_bd_intf_pins regslice_control_mgntpf/S_AXI]
connect_bd_intf_net [get_bd_intf_pins axi_cdc_data_M_AXI] [get_bd_intf_pins axi_cdc_data/M_AXI]
connect_bd_intf_net [get_bd_intf_pins axi_user_interconnect/M01_AXI] [get_bd_intf_pins interconnect_axilite_user/S00_AXI]
connect_bd_intf_net [get_bd_intf_pins M_AXI] [get_bd_intf_pins regslice_control_mgntpf/M_AXI]
connect_bd_intf_net [get_bd_intf_pins regslice_control_M_AXI] [get_bd_intf_pins axi_vip_control_mgntpf/S_AXI]
connect_bd_intf_net [get_bd_intf_pins axi_vip_data/M_AXI] [get_bd_intf_pins regslice_data/S_AXI]
connect_bd_intf_net [get_bd_intf_pins M_AXI1] [get_bd_intf_pins axi_user_slrcrossing_mi/M_AXI]
connect_bd_intf_net [get_bd_intf_pins axi_user_interconnect/M00_AXI] [get_bd_intf_pins axi_user_slrcrossing_mi/S_AXI]
connect_bd_net -net ARESETN_1 [get_bd_pins reset_controllers/psreset_gate_pr_control_interconnect_aresetn] \
  [get_bd_pins freq_counter_0/reset_n] [get_bd_pins axi_user_interconnect/ARESETN] \
  [get_bd_pins axi_user_interconnect/S00_ARESETN] [get_bd_pins axi_user_interconnect/M00_ARESETN] \
  [get_bd_pins axi_user_interconnect/M01_ARESETN] [get_bd_pins interconnect_axilite_user/ARESETN] \
  [get_bd_pins interconnect_axilite_user/S00_ARESETN] [get_bd_pins interconnect_axilite_user/M00_ARESETN] \
  [get_bd_pins axi_gpio_null/s_axi_aresetn] [get_bd_pins axi_user_slrcrossing_mi/aresetn] \
  [get_bd_pins axi_vip_control_mgntpf/aresetn] [get_bd_pins axi_vip_ctrl_userpf/aresetn] \
  [get_bd_pins regslice_control_mgntpf/aresetn]
connect_bd_net -net clkwiz_kernel2_clk_out1_1 [get_bd_pins clkwiz_kernel2_clk_out1] \
  [get_bd_pins freq_counter_0/test_clk1] [get_bd_pins reset_controllers/clkwiz_kernel2_clk_out1]
connect_bd_net -net clkwiz_kernel2_locked_1 [get_bd_pins clkwiz_kernel2_locked_slr0] [get_bd_pins reset_controllers/clkwiz_kernel2_locked_slr0]
connect_bd_net -net clkwiz_kernel_clk_out1_1 [get_bd_pins clkwiz_kernel_clk_out1] \
  [get_bd_pins freq_counter_0/test_clk0] [get_bd_pins reset_controllers/clkwiz_kernel_clk_out1] \
  [get_bd_pins axi_cdc_data/m_axi_aclk] [get_bd_pins interconnect_axilite_user/M01_ACLK] \
  [get_bd_pins interconnect_axilite_user/M02_ACLK] [get_bd_pins interconnect_axilite_user/M03_ACLK] \
  [get_bd_pins interconnect_axilite_user/M04_ACLK]
connect_bd_net -net clkwiz_kernel_locked_1 [get_bd_pins clkwiz_kernel_locked_slr0] [get_bd_pins reset_controllers/clkwiz_kernel_locked_slr0]
connect_bd_net -net clkwiz_sysclks_locked_1 [get_bd_pins clkwiz_sysclks_locked_slr0] [get_bd_pins reset_controllers/clkwiz_sysclks_locked_slr0]
connect_bd_net [get_bd_pins dma_pcie_axi_aclk] \
  [get_bd_pins reset_controllers/dma_pcie_axi_aclk] [get_bd_pins axi_cdc_data/s_axi_aclk] [get_bd_pins axi_vip_data/aclk] \
  [get_bd_pins regslice_data/aclk]
connect_bd_net -net pcie_user_lnk_up_1 [get_bd_pins pcie_user_lnk_up_slr0] [get_bd_pins reset_controllers/pcie_user_lnk_up_slr0]
connect_bd_net -net reset_controllers_interconnect_aresetn [get_bd_pins reset_controllers/psreset_gate_pr_data_interconnect_aresetn] \
  [get_bd_pins psreset_gate_pr_data_interconnect_aresetn] [get_bd_pins axi_cdc_data/s_axi_aresetn] \
  [get_bd_pins axi_vip_data/aresetn] [get_bd_pins regslice_data/aresetn]
connect_bd_net -net reset_controllers_interconnect_aresetn1 [get_bd_pins reset_controllers/psreset_gate_pr_kernel_interconnect_aresetn] \
  [get_bd_pins psreset_gate_pr_kernel_interconnect_aresetn] [get_bd_pins axi_cdc_data/m_axi_aresetn] \
  [get_bd_pins interconnect_axilite_user/M01_ARESETN] [get_bd_pins interconnect_axilite_user/M02_ARESETN] \
  [get_bd_pins interconnect_axilite_user/M03_ARESETN] [get_bd_pins interconnect_axilite_user/M04_ARESETN]
connect_bd_net -net slice_reset_kernel_pr_Dout_1 [get_bd_pins slice_reset_kernel_pr_Dout_slr0] \
  [get_bd_pins reset_controllers/slice_reset_kernel_pr_Dout_slr0]
connect_bd_net -net slowest_sync_clk_1 [get_bd_pins clkwiz_sysclks_clk_out2] \
  [get_bd_pins freq_counter_0/clk] [get_bd_pins reset_controllers/clkwiz_sysclks_clk_out2] \
  [get_bd_pins axi_user_interconnect/ACLK] [get_bd_pins axi_user_interconnect/S00_ACLK] \
  [get_bd_pins axi_user_interconnect/M00_ACLK] [get_bd_pins axi_user_interconnect/M01_ACLK] \
  [get_bd_pins interconnect_axilite_user/ACLK] [get_bd_pins interconnect_axilite_user/S00_ACLK] \
  [get_bd_pins interconnect_axilite_user/M00_ACLK] [get_bd_pins axi_gpio_null/s_axi_aclk] \
  [get_bd_pins axi_user_slrcrossing_mi/aclk] [get_bd_pins axi_vip_control_mgntpf/aclk] [get_bd_pins axi_vip_ctrl_userpf/aclk] \
  [get_bd_pins regslice_control_mgntpf/aclk]
connect_bd_net [get_bd_pins reset_controllers/peripheral_aresetn] [get_bd_pins peripheral_aresetn]
set_property PFM.AXI_PORT {M01_AXI {memport "M_AXI_GP"} M02_AXI {memport "M_AXI_GP"} M03_AXI {memport "M_AXI_GP"} M04_AXI {memport "M_AXI_GP"} M05_AXI {memport "M_AXI_GP"} M06_AXI {memport "M_AXI_GP"} M07_AXI {memport "M_AXI_GP"} M08_AXI {memport "M_AXI_GP"} M09_AXI {memport "M_AXI_GP"} M10_AXI {memport "M_AXI_GP"} M11_AXI {memport "M_AXI_GP"} M12_AXI {memport "M_AXI_GP"} M13_AXI {memport "M_AXI_GP"} M14_AXI {memport "M_AXI_GP"} M15_AXI {memport "M_AXI_GP"} M16_AXI {memport "M_AXI_GP"} M17_AXI {memport "M_AXI_GP"} M18_AXI {memport "M_AXI_GP"} M19_AXI {memport "M_AXI_GP"} M20_AXI {memport "M_AXI_GP"} M21_AXI {memport "M_AXI_GP"} M22_AXI {memport "M_AXI_GP"} M23_AXI {memport "M_AXI_GP"} M24_AXI {memport "M_AXI_GP"} M25_AXI {memport "M_AXI_GP"} M26_AXI {memport "M_AXI_GP"} M27_AXI {memport "M_AXI_GP"} M28_AXI {memport "M_AXI_GP"} M29_AXI {memport "M_AXI_GP"} M30_AXI {memport "M_AXI_GP"} M31_AXI {memport "M_AXI_GP"}} [get_bd_cells interconnect_axilite_user]

current_bd_instance /slr0/reset_controllers
connect_bd_net -net clkwiz_kernel2_locked_slr0_1 [get_bd_pins clkwiz_kernel2_locked_slr0] [get_bd_pins psreset_gate_pr_kernel2/dcm_locked]
connect_bd_net [get_bd_pins clkwiz_kernel_clk_out1] [get_bd_pins psreset_gate_pr_kernel/slowest_sync_clk]
connect_bd_net -net clkwiz_kernel_locked_slr0_1 [get_bd_pins clkwiz_kernel_locked_slr0] [get_bd_pins psreset_gate_pr_kernel/dcm_locked]
connect_bd_net -net clkwiz_sysclks_locked_slr0_1 [get_bd_pins clkwiz_sysclks_locked_slr0] [get_bd_pins psreset_gate_pr_control/dcm_locked]
connect_bd_net [get_bd_pins dma_pcie_axi_aclk] [get_bd_pins psreset_gate_pr_data/slowest_sync_clk]
connect_bd_net -net ext_reset_in_1 [get_bd_pins slice_reset_kernel_pr_Dout_slr0] \
  [get_bd_pins psreset_gate_pr_control/ext_reset_in] [get_bd_pins psreset_gate_pr_data/ext_reset_in] \
  [get_bd_pins psreset_gate_pr_kernel/ext_reset_in] [get_bd_pins psreset_gate_pr_kernel2/ext_reset_in]
connect_bd_net -net pcie_user_lnk_up_slr0_1 [get_bd_pins pcie_user_lnk_up_slr0] [get_bd_pins psreset_gate_pr_data/dcm_locked]
connect_bd_net [get_bd_pins psreset_gate_pr_control/interconnect_aresetn] [get_bd_pins psreset_gate_pr_control_interconnect_aresetn]
connect_bd_net [get_bd_pins psreset_gate_pr_data/interconnect_aresetn] [get_bd_pins psreset_gate_pr_data_interconnect_aresetn]
connect_bd_net [get_bd_pins psreset_gate_pr_kernel/interconnect_aresetn] [get_bd_pins psreset_gate_pr_kernel_interconnect_aresetn]
connect_bd_net -net slowest_sync_clk_1 [get_bd_pins clkwiz_sysclks_clk_out2] [get_bd_pins psreset_gate_pr_control/slowest_sync_clk]
connect_bd_net -net slowest_sync_clk_4 [get_bd_pins clkwiz_kernel2_clk_out1] [get_bd_pins psreset_gate_pr_kernel2/slowest_sync_clk]
connect_bd_net [get_bd_pins psreset_gate_pr_kernel/peripheral_aresetn] [get_bd_pins peripheral_aresetn]

current_bd_instance /slr1
connect_bd_intf_net [get_bd_intf_pins axi_user_interconnect/M00_AXI] [get_bd_intf_pins axi_user_slrcrossing_mi/S_AXI]
connect_bd_intf_net [get_bd_intf_pins axi_user_interconnect/S00_AXI] [get_bd_intf_pins axi_user_slrcrossing_si/M_AXI]
connect_bd_intf_net [get_bd_intf_pins M_AXI] [get_bd_intf_pins axi_user_slrcrossing_mi/M_AXI]
connect_bd_intf_net [get_bd_intf_pins regslice_data_M_AXI_slr1] [get_bd_intf_pins axi_vip_data/S_AXI]
connect_bd_intf_net [get_bd_intf_pins axi_cdc_data_M_AXI] [get_bd_intf_pins axi_cdc_data/M_AXI]
connect_bd_intf_net [get_bd_intf_pins axi_user_interconnect/M01_AXI] [get_bd_intf_pins interconnect_axilite_user/S00_AXI]
connect_bd_intf_net [get_bd_intf_pins axi_vip_data/M_AXI] [get_bd_intf_pins regslice_data/S_AXI]
connect_bd_intf_net [get_bd_intf_pins axi_cdc_data/S_AXI] [get_bd_intf_pins regslice_data/M_AXI]
connect_bd_intf_net [get_bd_intf_pins axi_gpio_null/S_AXI] [get_bd_intf_pins interconnect_axilite_user/M00_AXI]
connect_bd_intf_net [get_bd_intf_pins regslice_control_userpf_M_AXI_slr1] [get_bd_intf_pins axi_user_slrcrossing_si/S_AXI]
connect_bd_net -net ARESETN_1 [get_bd_pins reset_controllers/psreset_gate_pr_control_interconnect_aresetn] \
  [get_bd_pins axi_user_interconnect/ARESETN] [get_bd_pins axi_user_interconnect/S00_ARESETN] \
  [get_bd_pins axi_user_interconnect/M00_ARESETN] [get_bd_pins axi_user_interconnect/M01_ARESETN] \
  [get_bd_pins interconnect_axilite_user/ARESETN] [get_bd_pins interconnect_axilite_user/S00_ARESETN] \
  [get_bd_pins interconnect_axilite_user/M00_ARESETN] [get_bd_pins axi_gpio_null/s_axi_aresetn] \
  [get_bd_pins axi_user_slrcrossing_mi/aresetn] [get_bd_pins axi_user_slrcrossing_si/aresetn]
connect_bd_net -net clkwiz_kernel2_clk_out1_1 [get_bd_pins clkwiz_kernel2_clk_out1] [get_bd_pins reset_controllers/clkwiz_kernel2_clk_out1]
connect_bd_net -net clkwiz_kernel2_locked_1 [get_bd_pins clkwiz_kernel2_locked_slr1] [get_bd_pins reset_controllers/clkwiz_kernel2_locked_slr1]
connect_bd_net -net clkwiz_kernel_clk_out1_1 [get_bd_pins clkwiz_kernel_clk_out1] \
  [get_bd_pins reset_controllers/clkwiz_kernel_clk_out1] [get_bd_pins axi_cdc_data/m_axi_aclk]
connect_bd_net -net clkwiz_kernel_locked_1 [get_bd_pins clkwiz_kernel_locked_slr1] [get_bd_pins reset_controllers/clkwiz_kernel_locked_slr1]
connect_bd_net -net clkwiz_sysclks_locked_1 [get_bd_pins clkwiz_sysclks_locked_slr1] [get_bd_pins reset_controllers/clkwiz_sysclks_locked_slr1]
connect_bd_net [get_bd_pins dma_pcie_axi_aclk] \
  [get_bd_pins reset_controllers/dma_pcie_axi_aclk] [get_bd_pins axi_cdc_data/s_axi_aclk] [get_bd_pins axi_vip_data/aclk] \
  [get_bd_pins regslice_data/aclk]
connect_bd_net -net pcie_user_lnk_up_1 [get_bd_pins pcie_user_lnk_up_slr1] [get_bd_pins reset_controllers/pcie_user_lnk_up_slr1]
connect_bd_net -net reset_controllers_interconnect_aresetn [get_bd_pins reset_controllers/psreset_gate_pr_data_interconnect_aresetn] \
  [get_bd_pins axi_cdc_data/s_axi_aresetn] [get_bd_pins axi_vip_data/aresetn] [get_bd_pins regslice_data/aresetn]
connect_bd_net -net reset_controllers_interconnect_aresetn1 [get_bd_pins reset_controllers/psreset_gate_pr_kernel_interconnect_aresetn] \
  [get_bd_pins axi_cdc_data/m_axi_aresetn]
connect_bd_net -net slice_reset_kernel_pr_Dout_1 [get_bd_pins slice_reset_kernel_pr_Dout_slr1] \
  [get_bd_pins reset_controllers/slice_reset_kernel_pr_Dout_slr1]
connect_bd_net -net slowest_sync_clk_1 [get_bd_pins clkwiz_sysclks_clk_out2] \
  [get_bd_pins reset_controllers/clkwiz_sysclks_clk_out2] [get_bd_pins axi_user_interconnect/ACLK] \
  [get_bd_pins axi_user_interconnect/S00_ACLK] [get_bd_pins axi_user_interconnect/M00_ACLK] \
  [get_bd_pins axi_user_interconnect/M01_ACLK] [get_bd_pins interconnect_axilite_user/ACLK] \
  [get_bd_pins interconnect_axilite_user/S00_ACLK] [get_bd_pins interconnect_axilite_user/M00_ACLK] \
  [get_bd_pins axi_gpio_null/s_axi_aclk] [get_bd_pins axi_user_slrcrossing_mi/aclk] \
  [get_bd_pins axi_user_slrcrossing_si/aclk]
set_property PFM.AXI_PORT {M01_AXI {memport "M_AXI_GP"} M02_AXI {memport "M_AXI_GP"} M03_AXI {memport "M_AXI_GP"} M04_AXI {memport "M_AXI_GP"} M05_AXI {memport "M_AXI_GP"} M06_AXI {memport "M_AXI_GP"} M07_AXI {memport "M_AXI_GP"} M08_AXI {memport "M_AXI_GP"} M09_AXI {memport "M_AXI_GP"} M10_AXI {memport "M_AXI_GP"} M11_AXI {memport "M_AXI_GP"} M12_AXI {memport "M_AXI_GP"} M13_AXI {memport "M_AXI_GP"} M14_AXI {memport "M_AXI_GP"} M15_AXI {memport "M_AXI_GP"} M16_AXI {memport "M_AXI_GP"} M17_AXI {memport "M_AXI_GP"} M18_AXI {memport "M_AXI_GP"} M19_AXI {memport "M_AXI_GP"} M20_AXI {memport "M_AXI_GP"} M21_AXI {memport "M_AXI_GP"} M22_AXI {memport "M_AXI_GP"} M23_AXI {memport "M_AXI_GP"} M24_AXI {memport "M_AXI_GP"} M25_AXI {memport "M_AXI_GP"} M26_AXI {memport "M_AXI_GP"} M27_AXI {memport "M_AXI_GP"} M28_AXI {memport "M_AXI_GP"} M29_AXI {memport "M_AXI_GP"} M30_AXI {memport "M_AXI_GP"} M31_AXI {memport "M_AXI_GP"}} [get_bd_cells interconnect_axilite_user]

current_bd_instance /slr1/reset_controllers
connect_bd_net -net clkwiz_kernel2_locked_slr1_1 [get_bd_pins clkwiz_kernel2_locked_slr1] [get_bd_pins psreset_gate_pr_kernel2/dcm_locked]
connect_bd_net [get_bd_pins clkwiz_kernel_clk_out1] [get_bd_pins psreset_gate_pr_kernel/slowest_sync_clk]
connect_bd_net -net clkwiz_kernel_locked_slr1_1 [get_bd_pins clkwiz_kernel_locked_slr1] [get_bd_pins psreset_gate_pr_kernel/dcm_locked]
connect_bd_net -net clkwiz_sysclks_locked_slr1_1 [get_bd_pins clkwiz_sysclks_locked_slr1] [get_bd_pins psreset_gate_pr_control/dcm_locked]
connect_bd_net [get_bd_pins dma_pcie_axi_aclk] [get_bd_pins psreset_gate_pr_data/slowest_sync_clk]
connect_bd_net -net ext_reset_in_1 [get_bd_pins slice_reset_kernel_pr_Dout_slr1] \
  [get_bd_pins psreset_gate_pr_control/ext_reset_in] [get_bd_pins psreset_gate_pr_data/ext_reset_in] \
  [get_bd_pins psreset_gate_pr_kernel/ext_reset_in] [get_bd_pins psreset_gate_pr_kernel2/ext_reset_in]
connect_bd_net -net pcie_user_lnk_up_slr1_1 [get_bd_pins pcie_user_lnk_up_slr1] [get_bd_pins psreset_gate_pr_data/dcm_locked]
connect_bd_net [get_bd_pins psreset_gate_pr_control/interconnect_aresetn] [get_bd_pins psreset_gate_pr_control_interconnect_aresetn]
connect_bd_net [get_bd_pins psreset_gate_pr_data/interconnect_aresetn] [get_bd_pins psreset_gate_pr_data_interconnect_aresetn]
connect_bd_net [get_bd_pins psreset_gate_pr_kernel/interconnect_aresetn] [get_bd_pins psreset_gate_pr_kernel_interconnect_aresetn]
connect_bd_net -net slowest_sync_clk_1 [get_bd_pins clkwiz_sysclks_clk_out2] [get_bd_pins psreset_gate_pr_control/slowest_sync_clk]
connect_bd_net -net slowest_sync_clk_4 [get_bd_pins clkwiz_kernel2_clk_out1] [get_bd_pins psreset_gate_pr_kernel2/slowest_sync_clk]

current_bd_instance /slr2
connect_bd_intf_net [get_bd_intf_pins axi_user_interconnect/M00_AXI] [get_bd_intf_pins axi_user_slrcrossing_mi/S_AXI]
connect_bd_intf_net [get_bd_intf_pins axi_user_interconnect/S00_AXI] [get_bd_intf_pins axi_user_slrcrossing_si/M_AXI]
connect_bd_intf_net [get_bd_intf_pins M_AXI] [get_bd_intf_pins axi_user_slrcrossing_mi/M_AXI]
connect_bd_intf_net [get_bd_intf_pins regslice_data_M_AXI_slr2] [get_bd_intf_pins axi_vip_data/S_AXI]
connect_bd_intf_net [get_bd_intf_pins axi_cdc_data_M_AXI] [get_bd_intf_pins axi_cdc_data/M_AXI]
connect_bd_intf_net [get_bd_intf_pins axi_user_interconnect/M01_AXI] [get_bd_intf_pins interconnect_axilite_user/S00_AXI]
connect_bd_intf_net [get_bd_intf_pins axi_gpio_null/S_AXI] [get_bd_intf_pins interconnect_axilite_user/M00_AXI]
connect_bd_intf_net [get_bd_intf_pins axi_cdc_data/S_AXI] [get_bd_intf_pins regslice_data/M_AXI]
connect_bd_intf_net [get_bd_intf_pins axi_vip_data/M_AXI] [get_bd_intf_pins regslice_data/S_AXI]
connect_bd_intf_net [get_bd_intf_pins regslice_control_userpf_M_AXI_slr2] [get_bd_intf_pins axi_user_slrcrossing_si/S_AXI]
connect_bd_net -net ARESETN_1 [get_bd_pins reset_controllers/psreset_gate_pr_control_interconnect_aresetn] \
  [get_bd_pins axi_user_interconnect/ARESETN] [get_bd_pins axi_user_interconnect/S00_ARESETN] \
  [get_bd_pins axi_user_interconnect/M00_ARESETN] [get_bd_pins axi_user_interconnect/M01_ARESETN] \
  [get_bd_pins interconnect_axilite_user/ARESETN] [get_bd_pins interconnect_axilite_user/S00_ARESETN] \
  [get_bd_pins interconnect_axilite_user/M00_ARESETN] [get_bd_pins axi_gpio_null/s_axi_aresetn] \
  [get_bd_pins axi_user_slrcrossing_mi/aresetn] [get_bd_pins axi_user_slrcrossing_si/aresetn]
connect_bd_net -net clkwiz_kernel2_clk_out1_1 [get_bd_pins clkwiz_kernel2_clk_out1] [get_bd_pins reset_controllers/clkwiz_kernel2_clk_out1]
connect_bd_net -net clkwiz_kernel2_locked_1 [get_bd_pins clkwiz_kernel2_locked_slr2] [get_bd_pins reset_controllers/clkwiz_kernel2_locked_slr2]
connect_bd_net -net clkwiz_kernel_clk_out1_1 [get_bd_pins clkwiz_kernel_clk_out1] \
  [get_bd_pins reset_controllers/clkwiz_kernel_clk_out1] [get_bd_pins axi_cdc_data/m_axi_aclk]
connect_bd_net -net clkwiz_kernel_locked_1 [get_bd_pins clkwiz_kernel_locked_slr2] [get_bd_pins reset_controllers/clkwiz_kernel_locked_slr2]
connect_bd_net -net clkwiz_sysclks_locked_1 [get_bd_pins clkwiz_sysclks_locked_slr2] [get_bd_pins reset_controllers/clkwiz_sysclks_locked_slr2]
connect_bd_net [get_bd_pins dma_pcie_axi_aclk] \
  [get_bd_pins reset_controllers/dma_pcie_axi_aclk] [get_bd_pins axi_cdc_data/s_axi_aclk] [get_bd_pins axi_vip_data/aclk] \
  [get_bd_pins regslice_data/aclk]
connect_bd_net -net pcie_user_lnk_up_1 [get_bd_pins pcie_user_lnk_up_slr2] [get_bd_pins reset_controllers/pcie_user_lnk_up_slr2]
connect_bd_net -net reset_controllers_interconnect_aresetn [get_bd_pins reset_controllers/psreset_gate_pr_data_interconnect_aresetn] \
  [get_bd_pins axi_cdc_data/s_axi_aresetn] [get_bd_pins axi_vip_data/aresetn] [get_bd_pins regslice_data/aresetn]
connect_bd_net -net reset_controllers_interconnect_aresetn1 [get_bd_pins reset_controllers/psreset_gate_pr_kernel_interconnect_aresetn] \
  [get_bd_pins axi_cdc_data/m_axi_aresetn]
connect_bd_net -net slice_reset_kernel_pr_Dout_1 [get_bd_pins slice_reset_kernel_pr_Dout_slr2] \
  [get_bd_pins reset_controllers/slice_reset_kernel_pr_Dout_slr2]
connect_bd_net -net slowest_sync_clk_1 [get_bd_pins clkwiz_sysclks_clk_out2] \
  [get_bd_pins reset_controllers/clkwiz_sysclks_clk_out2] [get_bd_pins axi_user_interconnect/ACLK] \
  [get_bd_pins axi_user_interconnect/S00_ACLK] [get_bd_pins axi_user_interconnect/M00_ACLK] \
  [get_bd_pins axi_user_interconnect/M01_ACLK] [get_bd_pins interconnect_axilite_user/ACLK] \
  [get_bd_pins interconnect_axilite_user/S00_ACLK] [get_bd_pins interconnect_axilite_user/M00_ACLK] \
  [get_bd_pins axi_gpio_null/s_axi_aclk] [get_bd_pins axi_user_slrcrossing_mi/aclk] \
  [get_bd_pins axi_user_slrcrossing_si/aclk]
set_property PFM.AXI_PORT {M01_AXI {memport "M_AXI_GP"} M02_AXI {memport "M_AXI_GP"} M03_AXI {memport "M_AXI_GP"} M04_AXI {memport "M_AXI_GP"} M05_AXI {memport "M_AXI_GP"} M06_AXI {memport "M_AXI_GP"} M07_AXI {memport "M_AXI_GP"} M08_AXI {memport "M_AXI_GP"} M09_AXI {memport "M_AXI_GP"} M10_AXI {memport "M_AXI_GP"} M11_AXI {memport "M_AXI_GP"} M12_AXI {memport "M_AXI_GP"} M13_AXI {memport "M_AXI_GP"} M14_AXI {memport "M_AXI_GP"} M15_AXI {memport "M_AXI_GP"} M16_AXI {memport "M_AXI_GP"} M17_AXI {memport "M_AXI_GP"} M18_AXI {memport "M_AXI_GP"} M19_AXI {memport "M_AXI_GP"} M20_AXI {memport "M_AXI_GP"} M21_AXI {memport "M_AXI_GP"} M22_AXI {memport "M_AXI_GP"} M23_AXI {memport "M_AXI_GP"} M24_AXI {memport "M_AXI_GP"} M25_AXI {memport "M_AXI_GP"} M26_AXI {memport "M_AXI_GP"} M27_AXI {memport "M_AXI_GP"} M28_AXI {memport "M_AXI_GP"} M29_AXI {memport "M_AXI_GP"} M30_AXI {memport "M_AXI_GP"} M31_AXI {memport "M_AXI_GP"}} [get_bd_cells interconnect_axilite_user]
